# Altium schematic sheet top.SchDoc: Control Plane
size Letter; Author: Ye-Sheng Kuo; Revision: 2; SheetNumber: 1; SheetTotal: 8
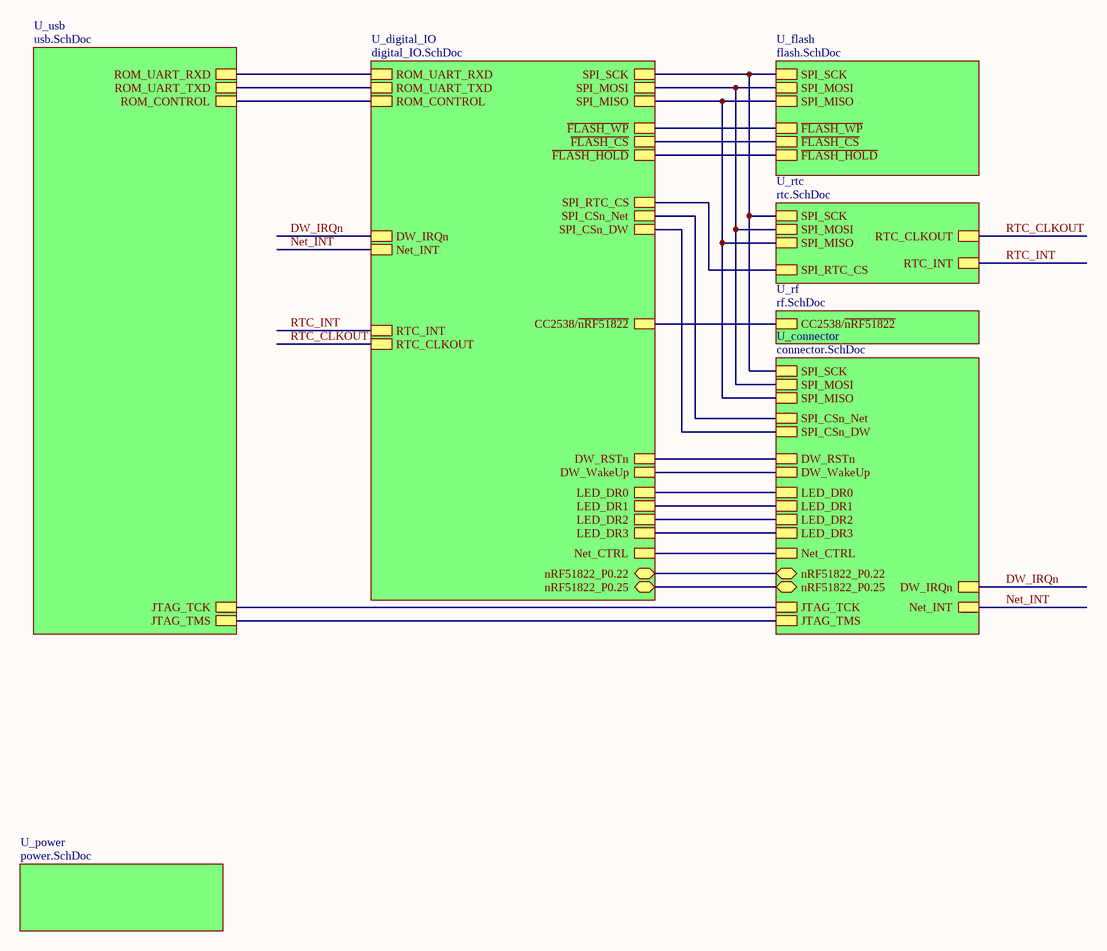
[diagram p0: top.SchDoc]

## Sub-sheets
U_connector = connector.SchDoc: JTAG_TCK, JTAG_TMS, SPI_SCK, SPI_MOSI, SPI_MISO, SPI_CSn_Net, DW_RSTn, DW_WakeUp, DW_IRQn, Net_INT, LED_DR0, LED_DR1, LED_DR2, LED_DR3, Net_CTRL, SPI_CSn_DW, nRF51822_P0.22, nRF51822_P0.25
U_digital_IO = digital_IO.SchDoc: ROM_UART_RXD, ROM_UART_TXD, ROM_CONTROL, ~{FLASH_WP}, ~{FLASH_CS}, ~{FLASH_HOLD}, RTC_CLKOUT, SPI_SCK, SPI_MOSI, SPI_MISO, CC2538/~{nRF51822}, SPI_RTC_CS, RTC_INT, SPI_CSn_Net, SPI_CSn_DW, DW_RSTn, DW_WakeUp, DW_IRQn, Net_INT, LED_DR0, LED_DR1, LED_DR2, LED_DR3, Net_CTRL, nRF51822_P0.22, nRF51822_P0.25
U_flash = flash.SchDoc: ~{FLASH_WP}, ~{FLASH_CS}, ~{FLASH_HOLD}, SPI_SCK, SPI_MOSI, SPI_MISO
U_power = power.SchDoc: no entries
U_rf = rf.SchDoc: CC2538/~{nRF51822}
U_rtc = rtc.SchDoc: SPI_SCK, SPI_MOSI, SPI_MISO, SPI_RTC_CS, RTC_INT, RTC_CLKOUT
U_usb = usb.SchDoc: ROM_UART_RXD, ROM_UART_TXD, ROM_CONTROL, JTAG_TCK, JTAG_TMS

## Nets
DW_IRQn: sheet U_digital_IO/DW_IRQn, sheet U_connector/DW_IRQn
Net_INT: sheet U_digital_IO/Net_INT, sheet U_connector/Net_INT
RTC_CLKOUT: sheet U_digital_IO/RTC_CLKOUT, sheet U_rtc/RTC_CLKOUT
RTC_INT: sheet U_digital_IO/RTC_INT, sheet U_rtc/RTC_INT
(unnamed): sheet U_digital_IO/ROM_UART_RXD, sheet U_usb/ROM_UART_RXD
(unnamed): sheet U_digital_IO/ROM_UART_TXD, sheet U_usb/ROM_UART_TXD
(unnamed): sheet U_digital_IO/ROM_CONTROL, sheet U_usb/ROM_CONTROL
(unnamed): sheet U_digital_IO/~{FLASH_WP}, sheet U_flash/~{FLASH_WP}
(unnamed): sheet U_digital_IO/~{FLASH_CS}, sheet U_flash/~{FLASH_CS}
(unnamed): sheet U_digital_IO/~{FLASH_HOLD}, sheet U_flash/~{FLASH_HOLD}
(unnamed): sheet U_digital_IO/SPI_SCK, sheet U_flash/SPI_SCK, sheet U_rtc/SPI_SCK, sheet U_connector/SPI_SCK
(unnamed): sheet U_digital_IO/SPI_MOSI, sheet U_flash/SPI_MOSI, sheet U_rtc/SPI_MOSI, sheet U_connector/SPI_MOSI
(unnamed): sheet U_digital_IO/SPI_MISO, sheet U_flash/SPI_MISO, sheet U_rtc/SPI_MISO, sheet U_connector/SPI_MISO
(unnamed): sheet U_digital_IO/CC2538/~{nRF51822}, sheet U_rf/CC2538/~{nRF51822}
(unnamed): sheet U_digital_IO/SPI_RTC_CS, sheet U_rtc/SPI_RTC_CS
(unnamed): sheet U_digital_IO/SPI_CSn_Net, sheet U_connector/SPI_CSn_Net
(unnamed): sheet U_digital_IO/SPI_CSn_DW, sheet U_connector/SPI_CSn_DW
(unnamed): sheet U_digital_IO/DW_RSTn, sheet U_connector/DW_RSTn
(unnamed): sheet U_digital_IO/DW_WakeUp, sheet U_connector/DW_WakeUp
(unnamed): sheet U_digital_IO/LED_DR0, sheet U_connector/LED_DR0
(unnamed): sheet U_digital_IO/LED_DR1, sheet U_connector/LED_DR1
(unnamed): sheet U_digital_IO/LED_DR2, sheet U_connector/LED_DR2
(unnamed): sheet U_digital_IO/LED_DR3, sheet U_connector/LED_DR3
(unnamed): sheet U_digital_IO/Net_CTRL, sheet U_connector/Net_CTRL
(unnamed): sheet U_digital_IO/nRF51822_P0.22, sheet U_connector/nRF51822_P0.22
(unnamed): sheet U_digital_IO/nRF51822_P0.25, sheet U_connector/nRF51822_P0.25
(unnamed): sheet U_usb/JTAG_TCK, sheet U_connector/JTAG_TCK
(unnamed): sheet U_usb/JTAG_TMS, sheet U_connector/JTAG_TMS

## Notes on the sheet
- Title
- Date:
- Author:
- Revision:
- Sheet
- of
- University of Michigan
- File: